# EAGLE design smartsensor_jig (EAGLE 6.5.0)
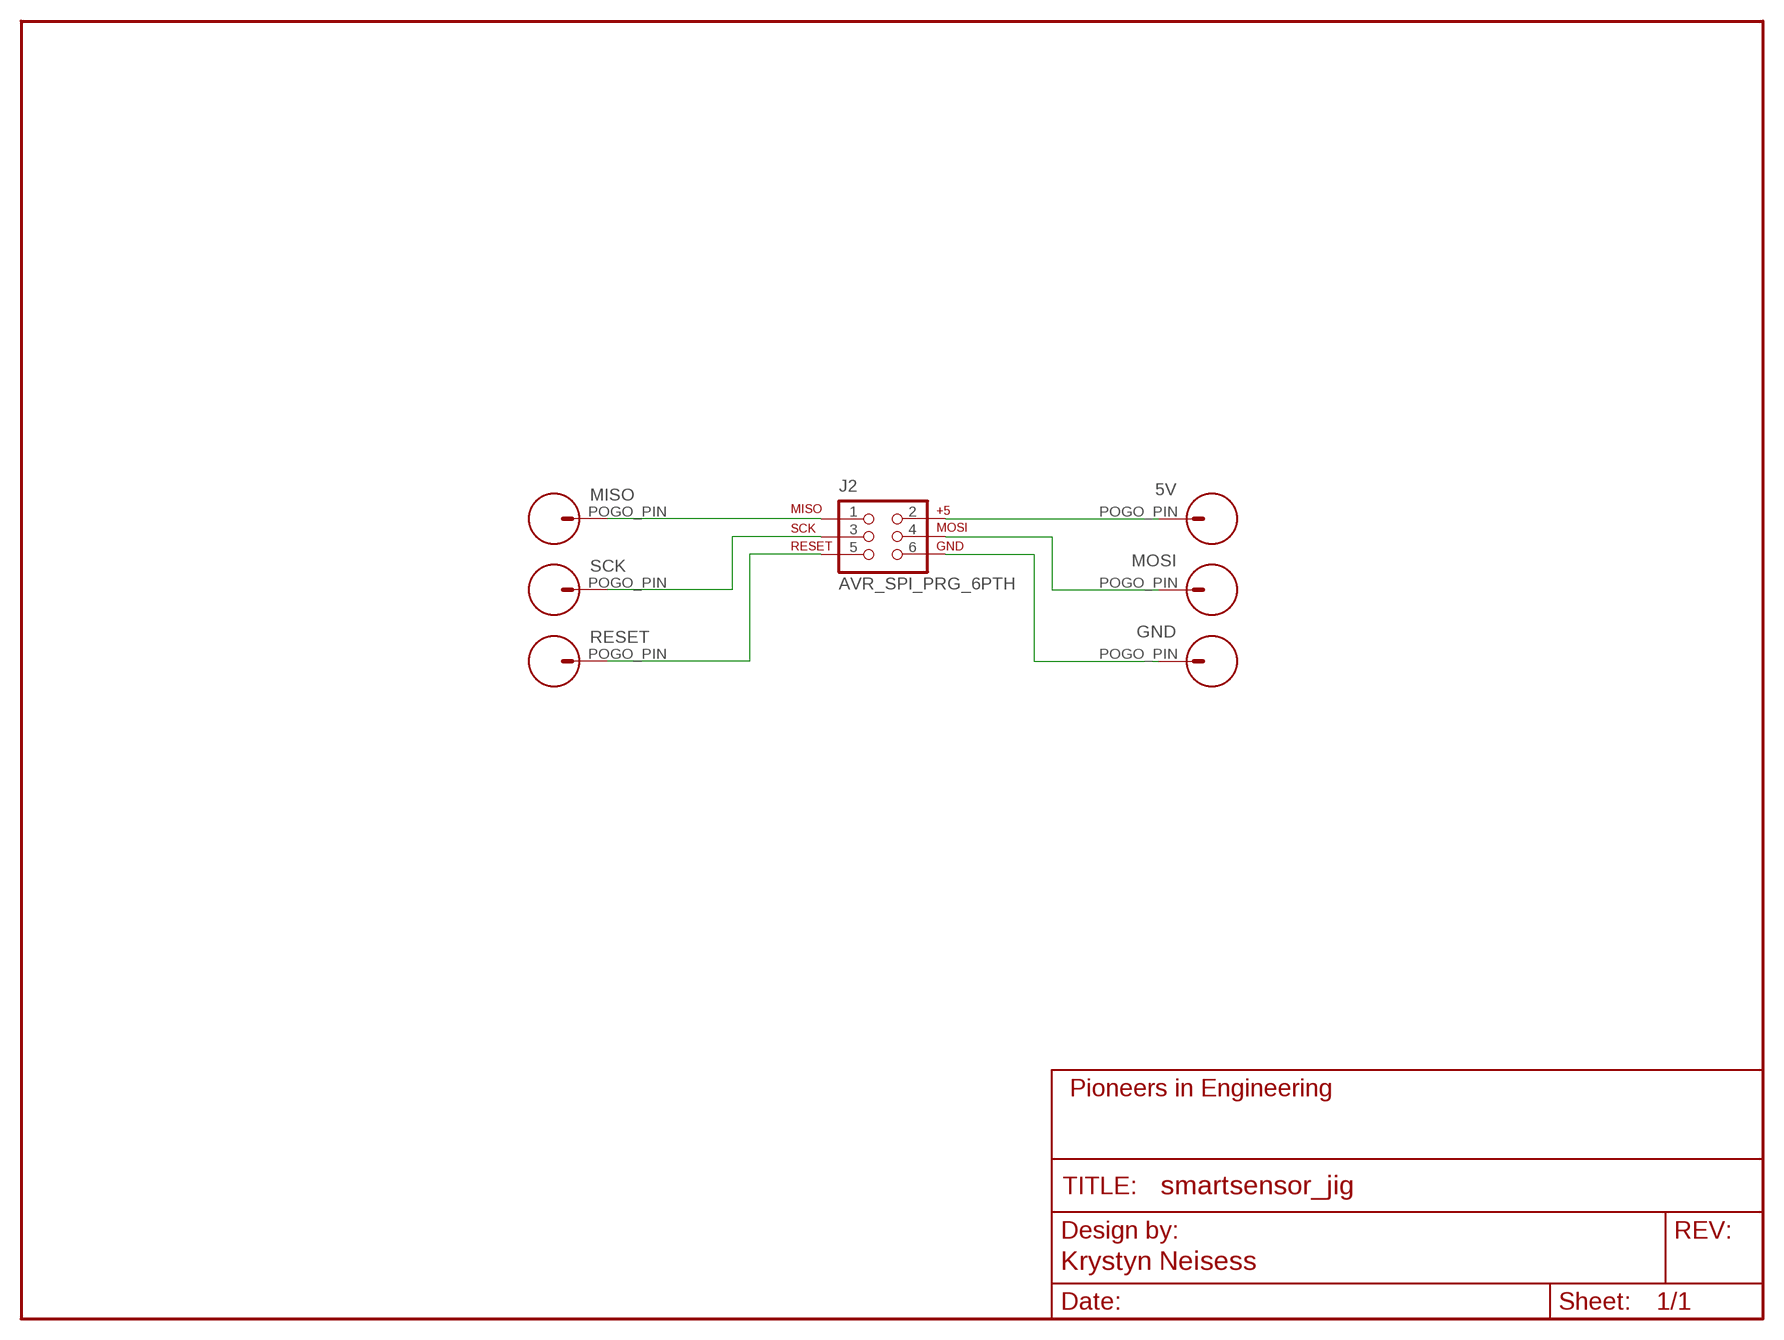
[diagram p0: schematic, sheet 1]
FRAME1 (FRAME-LETTER): AUTHOR: Krystyn Neisess; REVISION: 1B

## Parts
5V  POGO_PIN  [POGO_PIN_394]
GND  POGO_PIN  [POGO_PIN_394]
J2  AVR_SPI_PRG_6PTH  [2X3]
MISO  POGO_PIN  [POGO_PIN_394]
MOSI  POGO_PIN  [POGO_PIN_394]
RESET  POGO_PIN  [POGO_PIN_394]
SCK  POGO_PIN  [POGO_PIN_394]

## Nets
5V: 5V.POGO_PIN J2.2
GND: GND.POGO_PIN J2.6
MISO: J2.1 MISO.POGO_PIN
MOSI: J2.4 MOSI.POGO_PIN
RESET: J2.5 RESET.POGO_PIN
SCK: J2.3 SCK.POGO_PIN

## Library data of the parts
5V GND MISO MOSI RESET SCK = pie:POGO_PIN: Pogo Pin Mounting/Probing Pad; PIE-INT-REF-NUM: POGO-PIN
J2 = pie:AVR_SPI_PRG_6: AVR ISP 6 Pin This is the reduced ISP connector for AVR programming. Common on Arduino. This footprint will take up less PCB space and can be used with a 10-pin to 6-pin adapter such as SKU: BOB-08508; PIE-INT-REF-NUM: BULK-STOCK

## Board
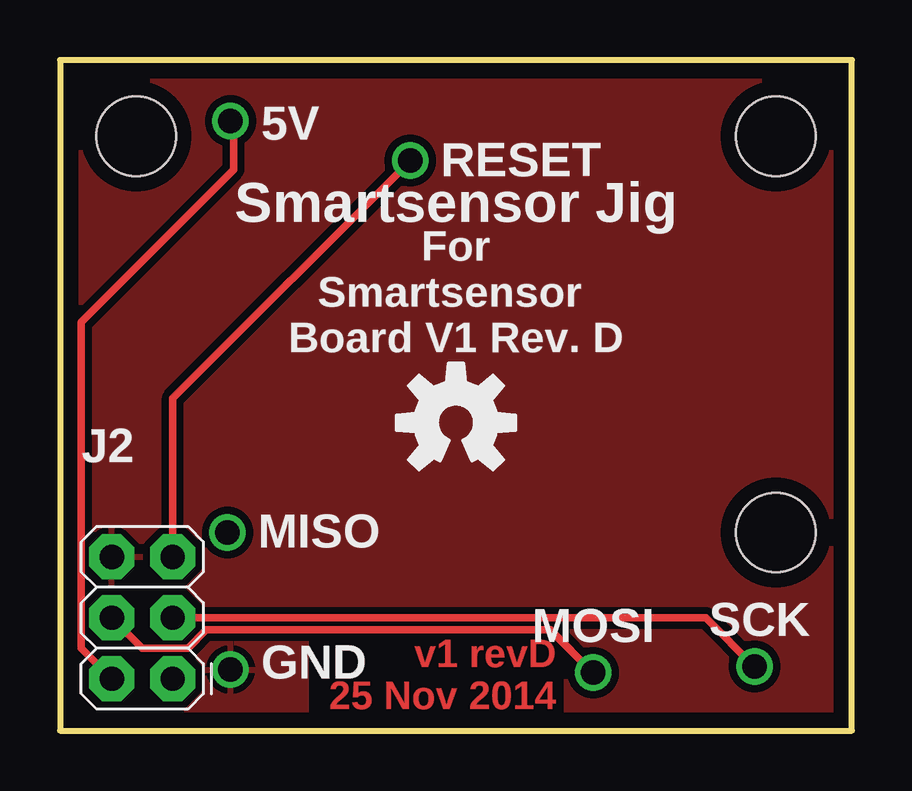
[diagram p1: board, top side]
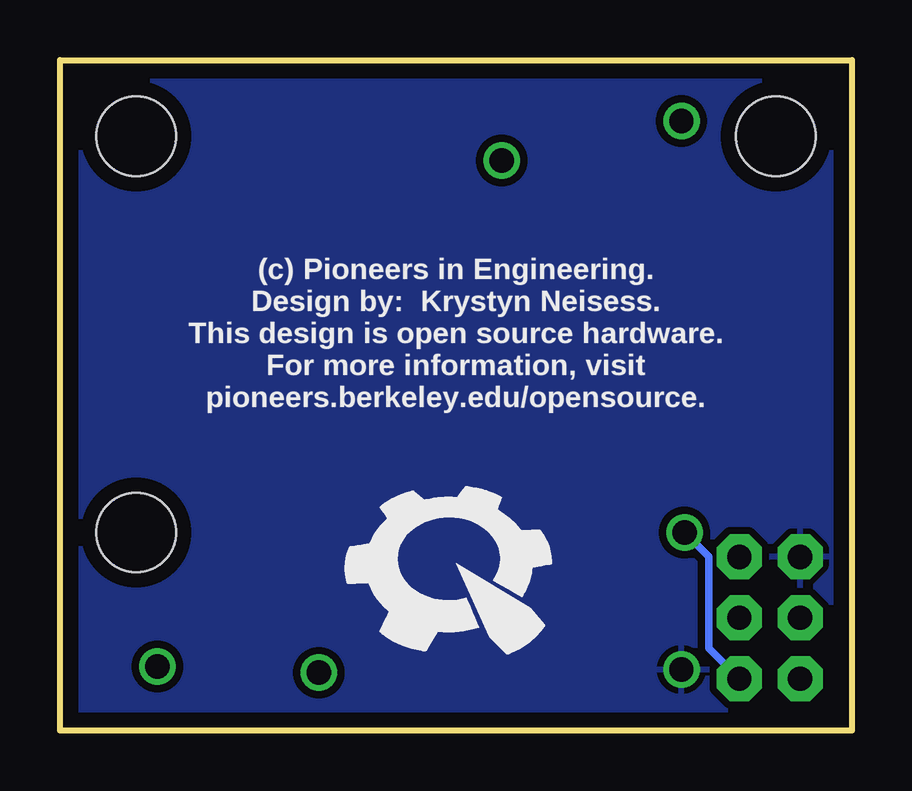
[diagram p2: board, bottom side, seen from below]

Size 33.02 x 27.94 mm. Coordinates in mm from the lower left corner, seen from the top.
Outline: 0,0 33.02,0 33.02,27.94 0,27.94 0,0
Copper layers (1*16): Top 2mil / dielectric 9mil / Bottom 2mil
Design rules "advancedcircuits-33each-pie": minimum track width 6mil, minimum drill 15mil, track to track 6mil, track to pad 6mil, pad to pad 6mil, via to via 6mil, smd to smd 6mil, copper to edge 25mil, drill to drill 7mil, minimum pad ring 7mil, minimum via ring 7mil, stop-mask expansion 3mil, vias tented up to drill 21mil, thermal gap 10mil

### Footprints (pad centres in the part's own frame; a part is rotated, then mirrored left to right if it is on the bottom)
POGO_PIN_394 = drill 1.016 pad 1.524: POGO_PIN 0,0
2X3 = drill 1.016 pad 1.88 octagon: 1 0,0; 2 0,2.54; 3 2.54,0; 4 2.54,2.54; 5 5.08,0; 6 5.08,2.54
STAND-OFF = hole 3.302: 0,0

### Placement (x,y rotation side)
5V  7.11,25.4 270 top
GND  7.11,2.54 90 top
J2  4.7,2.16 90 top
MISO  6.99,8.26 0 top
MOSI  22.23,2.41 0 top
RESET  14.61,23.75 270 top
SCK  28.96,2.67 0 top
U$1  [OSHW-LOGO-M]  16.51,12.83 0 top
U$2  [PIE-LOGO-SMALL]  16.51,6.99 0 bottom
U$3  [STAND-OFF]  29.84,8.26 0 top
U$4  [STAND-OFF]  3.17,24.77 0 top
U$5  [STAND-OFF]  29.84,24.77 0 top

### Tracks (layer width: path | path; a pad name or v marks a point on that pad's centre or on a via)
5V
  Top 0.305: J2.2 0.89,3.43 0.89,17.02 7.24,23.37 7.24,25.27 5V.POGO_PIN
GND
  pour Bottom (isolate 0.305): 0,0 0,27.94 33.02,27.94 33.02,0
  pour Top (isolate 0.305): 0,0 0,27.94 33.02,27.94 33.02,0
MISO
  Bottom 0.305: J2.1 5.97,3.43 5.97,7.24 MISO.POGO_PIN
MOSI
  Top 0.305: J2.4 3.43,3.43 5.33,3.43 6.1,4.19 20.45,4.19 MOSI.POGO_PIN 20.57,4.06
RESET
  Top 0.305: J2.5 4.7,13.84 RESET.POGO_PIN
SCK
  Top 0.305: J2.3 26.92,4.7 SCK.POGO_PIN

### Text on the board
Top: v1 revD / 25 Nov 2014
tPlace: Smartsensor Jig | For / Smartsensor / Board V1 Rev. D
bPlace: (c) Pioneers in Engineering. / Design by: Krystyn Neisess. / This design is open source hardware. / For more information, visit / pioneers.berkeley.edu/opensource.